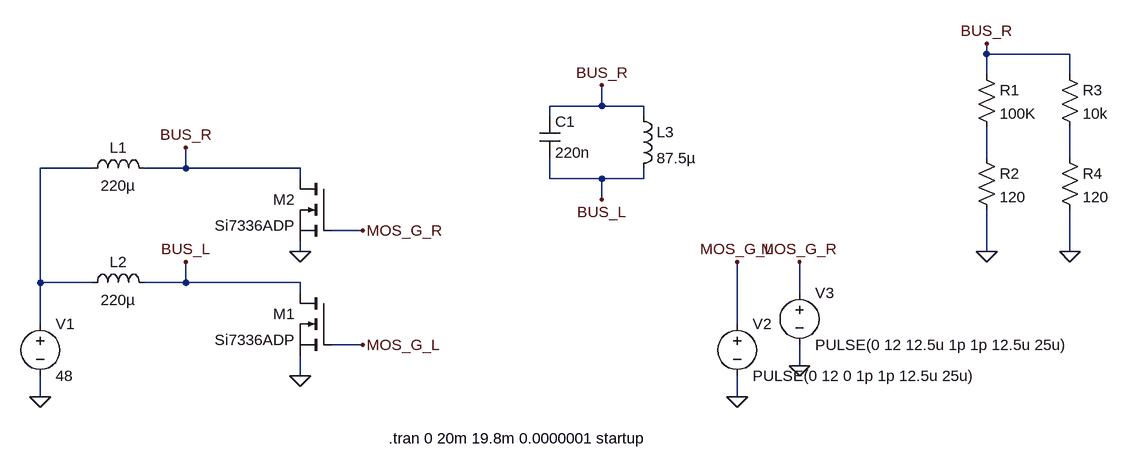
[diagram p0: schematic induction-heater-manual-control.asc]
induction-heater-manual-control.asc, the LTspice schematic file:
Version 4
SHEET 1 2072 680
WIRE 1456 -128 1456 -144
WIRE 1584 -128 1456 -128
WIRE 1456 -96 1456 -128
WIRE 1584 -96 1584 -128
WIRE 864 -48 864 -80
WIRE 864 -48 784 -48
WIRE 928 -48 864 -48
WIRE 784 -32 784 -48
WIRE 928 -32 928 -48
WIRE 1456 32 1456 -16
WIRE 1584 32 1584 -16
WIRE 80 48 0 48
WIRE 224 48 224 16
WIRE 224 48 160 48
WIRE 400 48 224 48
WIRE 400 64 400 48
WIRE 784 64 784 32
WIRE 864 64 784 64
WIRE 928 64 928 48
WIRE 928 64 864 64
WIRE 864 96 864 64
WIRE 496 144 448 144
WIRE 400 176 400 160
WIRE 1456 176 1456 112
WIRE 1584 176 1584 112
WIRE 0 224 0 48
WIRE 80 224 0 224
WIRE 224 224 224 192
WIRE 224 224 160 224
WIRE 400 224 224 224
WIRE 400 240 400 224
WIRE 1168 240 1168 192
WIRE 0 288 0 224
WIRE 1072 288 1072 192
WIRE 496 320 448 320
WIRE 1168 352 1168 320
WIRE 400 368 400 336
WIRE 0 400 0 368
WIRE 1072 400 1072 368
FLAG 0 400 0
FLAG 400 368 0
FLAG 400 176 0
FLAG 496 144 MOS_G_R
FLAG 496 320 MOS_G_L
FLAG 224 16 BUS_R
FLAG 224 192 BUS_L
FLAG 864 -80 BUS_R
FLAG 864 96 BUS_L
FLAG 1072 400 0
FLAG 1168 352 0
FLAG 1168 192 MOS_G_R
FLAG 1072 192 MOS_G_L
FLAG 1456 -144 BUS_R
FLAG 1456 176 0
FLAG 1584 176 0
SYMBOL voltage 0 272 R0
WINDOW 123 0 0 Left 0
WINDOW 39 24 124 Left 2
SYMATTR InstName V1
SYMATTR Value 48
SYMBOL ind 64 64 R270
WINDOW 0 32 56 VTop 2
WINDOW 3 5 56 VBottom 2
SYMATTR InstName L1
SYMATTR Value 220µ
SYMBOL ind 64 240 R270
WINDOW 0 32 56 VTop 2
WINDOW 3 5 56 VBottom 2
SYMATTR InstName L2
SYMATTR Value 220µ
SYMBOL nmos 448 240 M0
SYMATTR InstName M1
SYMATTR Value Si7336ADP
SYMBOL nmos 448 64 M0
SYMATTR InstName M2
SYMATTR Value Si7336ADP
SYMBOL ind 912 -48 R0
SYMATTR InstName L3
SYMATTR Value 87.5µ
SYMBOL cap 768 -32 R0
SYMATTR InstName C1
SYMATTR Value 220n
SYMBOL voltage 1072 272 R0
WINDOW 123 0 0 Left 0
WINDOW 39 0 0 Left 0
SYMATTR InstName V2
SYMATTR Value PULSE(0 12 0 1p 1p 12.5u 25u)
SYMBOL voltage 1168 224 R0
WINDOW 123 0 0 Left 0
WINDOW 39 0 0 Left 0
SYMATTR InstName V3
SYMATTR Value PULSE(0 12 12.5u 1p 1p 12.5u 25u)
SYMBOL res 1440 -112 R0
SYMATTR InstName R1
SYMATTR Value 100K
SYMBOL res 1440 16 R0
SYMATTR InstName R2
SYMATTR Value 120
SYMBOL res 1568 -112 R0
SYMATTR InstName R3
SYMATTR Value 10k
SYMBOL res 1568 16 R0
SYMATTR InstName R4
SYMATTR Value 120
TEXT 536 464 Left 2 !.tran 0 20m 19.8m 0.0000001 startup

The netlist it stands for:
* induction-heater-manual-control.asc
V1 N003 0 48
L1 N003 BUS_R 220µ
L2 N003 BUS_L 220µ
M1 BUS_L MOS_G_L 0 0 Si7336ADP
M2 BUS_R MOS_G_R 0 0 Si7336ADP
L3 BUS_R BUS_L 87.5µ
C1 BUS_R BUS_L 220n
V2 MOS_G_L 0 PULSE(0 12 0 1p 1p 12.5u 25u)
V3 MOS_G_R 0 PULSE(0 12 12.5u 1p 1p 12.5u 25u)
R1 BUS_R N001 100K
R2 N001 0 120
R3 BUS_R N002 10k
R4 N002 0 120
.model NMOS NMOS
.model PMOS PMOS
.lib standard.mos
.tran 0 20m 19.8m 0.0000001 startup
.backanno
.end